# EAGLE schematic arm (EAGLE 5.11)
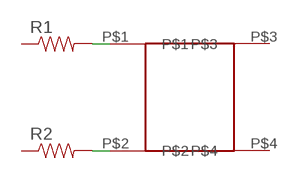
[diagram p0: schematic, sheet 1]

## Parts
R1  RESISTOR  [0805]
R2  RESISTOR  [0805]
U$1  SLOT  [SLOT]

## Nets
N$7: R1.2 U$1.P$1
N$8: R2.2 U$1.P$2
Unconnected: R1.1 R2.1 U$1.P$3 U$1.P$4

## Library data of the parts
R1 R2 = SparkFun:RESISTOR: Resistor Basic schematic elements and footprints for 0603, 1206, and PTH 1/10th watt (small) resistors.
U$1 = NSL_MiniQuad:SLOT